# Altium schematic sheet MSXII_driverControlsBlockDiagram.SchDoc: Block Diagram
size Letter; Author: Norman Chong; Organization: Midnight Sun Solar Rayce Car Team; Address1: University of Waterloo; Address2: 200 University Ave W; Address3: Waterloo, ON, Canada; Address4: N2L 3E9; Revision: 1.1; SheetNumber: 1; Website: www.uwmidsun.com
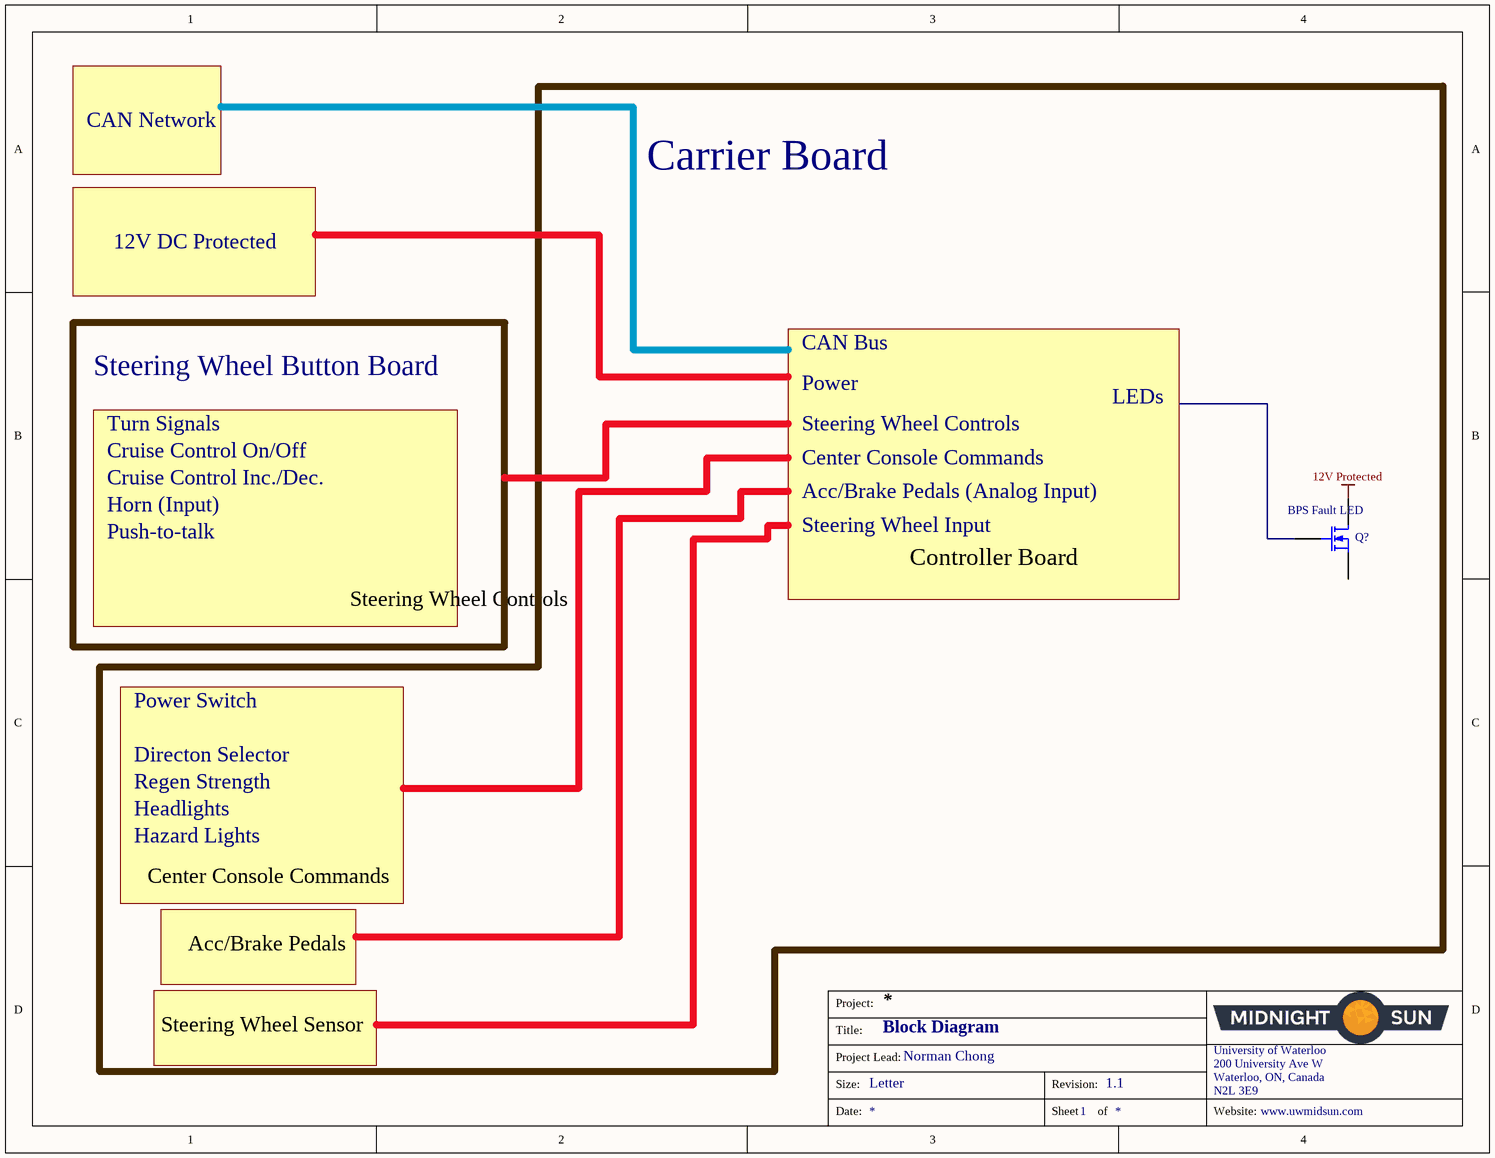
[diagram p0: MSXII_driverControlsBlockDiagram.SchDoc]

## Parts
Q?  BPS Fault LED  [N-CH MOSFET SOT-23]

## Blocks framed on the sheet
Carrier Board: Q?

## Nets
12V Protected: Q?.3(D)

Not connected (* = marked no-connect by the designer): Q? 1(G) 2(S)

## Notes on the sheet
- CAN Network
- 12V DC Protected
- CAN Bus
- Steering Wheel Button Board
- Turn Signals
- Power
- Steering Wheel Controls
- LEDs
- Cruise Control Inc./Dec.
- Cruise Control On/Off
- Center Console Commands
- Acc/Brake Pedals (Analog Input)
- Horn (Input)
- Push-to-talk
- Steering Wheel Input
- Controller Board
- Power Switch
- Directon Selector
- Regen Strength
- Headlights
- Hazard Lights
- Acc/Brake Pedals
- Steering Wheel Sensor
- Project:
- Title:
- Size:
- Project Lead:
- Letter
- Revision:
- University of Waterloo
- 200 University Ave W
- Waterloo, ON, Canada
- N2L 3E9
- Date:
- Sheet
- of
- Website:

## Library data of the parts
Q? = MOSFET N-CH 60V 4A 3.3W SOT-223: N-Channel 60V 4A (Tc) 3.3W (Tc) Surface Mount SOT-223; Manufacturer 1: STMicroelectronics; Manufacturer Part Number 1: STN3NF06L; Current - Continuous Drain (Id) @ 25°C: 4A (Tc); Drive Voltage (Max Rds On,  Min Rds On): 5V, 10V; Vgs(th) (Max) @ Id: 2.8V @ 250µA; Gate Charge (Qg) (Max) @ Vgs: 9nC @ 5V; Input Capacitance (Ciss) (Max) @ Vds: 340pF @ 25V; Vgs (Max): ±16V; Rds On (Max) @ Id, Vgs: 100 mOhm @ 1.5A, 10V; Supplier 1: Digi-Key; Supplier Part Number 1: 497-3177-1-ND; Packaging: Cut Tape (CT); Part Status: Active; FET Type: N-Channel; Technology: MOSFET (Metal Oxide); Drain to Source Voltage (Vdss): 60V; FET Feature: -; Power Dissipation (Max): 3.3W (Tc); Operating Temperature: -55°C ~ 150°C (TJ); Mounting Type: Surface Mount; Supplier Device Package: SOT-223; Package / Case: TO-261-4, TO-261AA; ComponentLink1URL: http://www.st.com/content/ccc/resource/technical/document/datasheet/b1/52/93/f0/a9/a9/40/d7/CD00002430.pdf/files/CD00002430.pdf/jcr:content/translations/en.CD00002430.pdf; ComponentLink1Description: http://www.st.com/content/ccc/resource/technical/document/datasheet/b1/52/93/f0/a9/a9/40/d7/CD00002430.pdf/files/CD00002430.pdf/jcr:content/translations/en.CD00002430.pdf